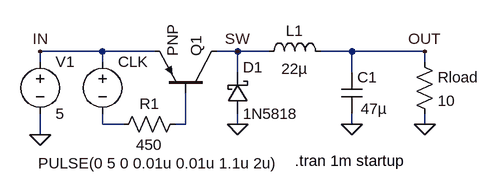
[diagram p0: schematic StepDown.asc]
StepDown.asc, the LTspice schematic file:
Version 4
SHEET 1 2900 1300
WIRE 2112 976 2016 976
WIRE 2192 976 2112 976
WIRE 2320 976 2288 976
WIRE 2368 976 2320 976
WIRE 2496 976 2448 976
WIRE 2608 976 2496 976
WIRE 2016 992 2016 976
WIRE 2112 992 2112 976
WIRE 2608 992 2608 976
WIRE 2320 1008 2320 976
WIRE 2496 1008 2496 976
WIRE 2112 1088 2112 1072
WIRE 2144 1088 2112 1088
WIRE 2240 1088 2240 1040
WIRE 2240 1088 2224 1088
WIRE 2320 1088 2320 1072
WIRE 2496 1088 2496 1072
WIRE 2608 1088 2608 1072
WIRE 2016 1104 2016 1072
FLAG 2016 1104 0
FLAG 2320 1088 0
FLAG 2496 1088 0
FLAG 2608 1088 0
FLAG 2608 976 OUT
FLAG 2016 976 IN
FLAG 2320 976 SW
SYMBOL VOLTAGE 2016 976 R0
SYMATTR InstName V1
SYMATTR Value 5
SYMBOL schottky 2304 1072 M180
WINDOW 0 24 72 Left 0
WINDOW 3 24 0 Left 0
SYMATTR InstName D1
SYMATTR Value 1N5818
SYMBOL ind 2352 992 R270
WINDOW 0 32 56 VTop 0
WINDOW 3 5 56 VBottom 0
SYMATTR InstName L1
SYMATTR Value 22µ
SYMATTR SpiceLine Rpar=10k
SYMBOL cap 2480 1008 R0
WINDOW 123 31 81 Left 0
WINDOW 3 30 56 Left 0
SYMATTR Value 47µ
SYMATTR InstName C1
SYMBOL res 2592 976 R0
SYMATTR InstName Rload
SYMATTR Value 10
SYMBOL pnp 2288 1040 M270
SYMATTR InstName Q1
SYMBOL voltage 2112 976 R0
WINDOW 3 -99 172 Left 0
WINDOW 123 0 0 Left 0
WINDOW 39 0 0 Left 0
SYMATTR InstName CLK
SYMATTR Value PULSE(0 5 0 0.01u 0.01u 1.1u 2u)
SYMBOL res 2240 1072 R90
WINDOW 0 0 56 VBottom 0
WINDOW 3 32 56 VTop 0
SYMATTR InstName R1
SYMATTR Value 450
TEXT 2408 1144 Left 0 !.tran 1m startup

The netlist it stands for:
* StepDown.asc
V1 IN 0 5
D1 0 SW 1N5818
L1 SW OUT 22µ Rpar=10k
C1 OUT 0 47µ
Rload OUT 0 10
Q1 SW N002 IN 0 PNP
V§CLK IN N001 PULSE(0 5 0 0.01u 0.01u 1.1u 2u)
R1 N002 N001 450
.model D D
.lib standard.dio
.model NPN NPN
.model PNP PNP
.lib standard.bjt
.tran 1m startup
.backanno
.end